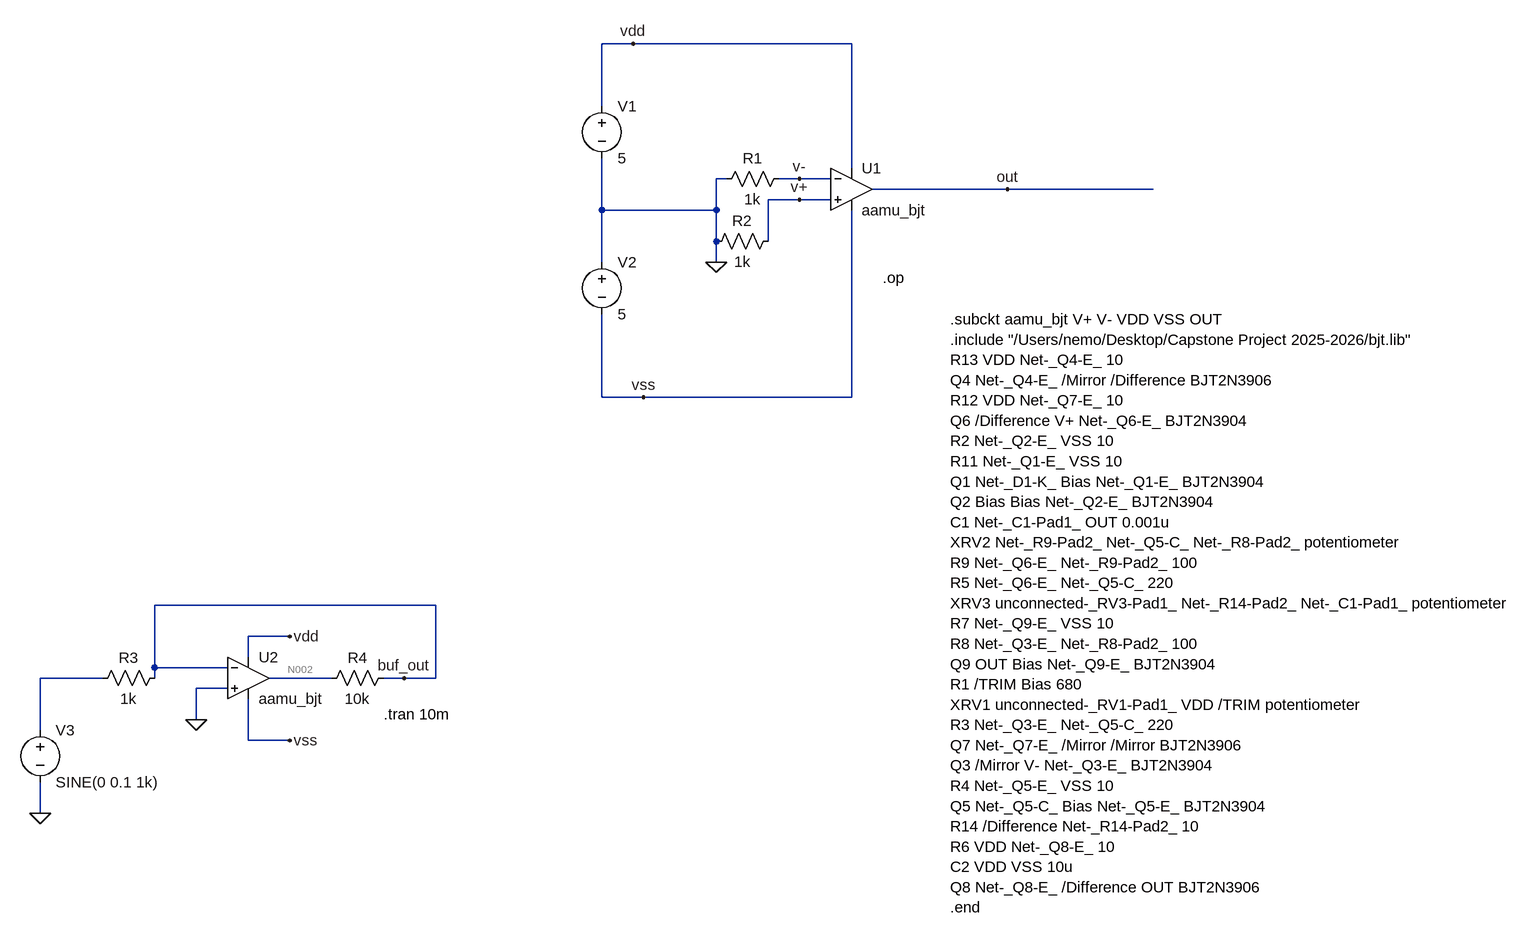
[diagram p0: schematic BJT_Op-Amp_Test.asc]
BJT_Op-Amp_Test.asc, the LTspice schematic file:
Version 4
SHEET 1 1656 1208
WIRE 176 0 128 0
WIRE 512 0 176 0
WIRE 128 96 128 0
WIRE 512 192 512 0
WIRE 320 208 304 208
WIRE 432 208 400 208
WIRE 480 208 432 208
WIRE 752 224 544 224
WIRE 976 224 752 224
WIRE 432 240 384 240
WIRE 480 240 432 240
WIRE 128 256 128 176
WIRE 304 256 304 208
WIRE 304 256 128 256
WIRE 304 304 304 256
WIRE 384 304 384 240
WIRE 128 336 128 256
WIRE 304 336 304 304
WIRE 128 544 128 416
WIRE 192 544 128 544
WIRE 512 544 512 256
WIRE 512 544 192 544
WIRE -128 864 -560 864
WIRE -352 912 -416 912
WIRE -416 944 -416 912
WIRE -560 960 -560 864
WIRE -448 960 -560 960
WIRE -640 976 -736 976
WIRE -560 976 -560 960
WIRE -288 976 -384 976
WIRE -176 976 -208 976
WIRE -128 976 -128 864
WIRE -128 976 -176 976
WIRE -448 992 -496 992
WIRE -496 1040 -496 992
WIRE -736 1056 -736 976
WIRE -416 1072 -416 1008
WIRE -352 1072 -416 1072
WIRE -736 1184 -736 1136
FLAG 304 336 0
FLAG 752 224 out
FLAG 176 0 vdd
FLAG 192 544 vss
FLAG 432 208 v-
FLAG 432 240 v+
FLAG -736 1184 0
FLAG -496 1040 0
FLAG -352 912 vdd
FLAG -352 1072 vss
FLAG -176 976 buf_out
DATAFLAG 896 224 "$"
DATAFLAG 384 0 "$"
DATAFLAG 432 544 "$"
SYMBOL OpAmps/opamp2 512 160 R0
SYMATTR InstName U1
SYMATTR Value aamu_bjt
SYMBOL voltage 128 80 R0
SYMATTR InstName V1
SYMATTR Value 5
SYMBOL voltage 128 320 R0
SYMATTR InstName V2
SYMATTR Value 5
SYMBOL res 416 192 R90
WINDOW 0 0 56 VBottom 2
WINDOW 3 32 56 VTop 2
SYMATTR InstName R1
SYMATTR Value 1k
SYMBOL res 400 288 R90
WINDOW 0 0 56 VBottom 2
WINDOW 3 32 56 VTop 2
SYMATTR InstName R2
SYMATTR Value 1k
SYMBOL OpAmps/opamp2 -416 912 R0
SYMATTR InstName U2
SYMATTR Value aamu_bjt
SYMBOL res -544 960 R90
WINDOW 0 0 56 VBottom 2
WINDOW 3 32 56 VTop 2
SYMATTR InstName R3
SYMATTR Value 1k
SYMBOL res -192 960 R90
WINDOW 0 0 56 VBottom 2
WINDOW 3 32 56 VTop 2
SYMATTR InstName R4
SYMATTR Value 10k
SYMBOL voltage -736 1040 R0
SYMATTR InstName V3
SYMATTR Value SINE(0 0.1 1k)
TEXT 560 360 Left 2 !.op
TEXT 664 424 Left 2 !.subckt aamu_bjt V+ V- VDD VSS OUT\n.include "/Users/nemo/Desktop/Capstone Project 2025-2026/bjt.lib"\nR13 VDD Net-_Q4-E_ 10\nQ4 Net-_Q4-E_ /Mirror /Difference BJT2N3906\nR12 VDD Net-_Q7-E_ 10\nQ6 /Difference V+ Net-_Q6-E_ BJT2N3904\nR2 Net-_Q2-E_ VSS 10\nR11 Net-_Q1-E_ VSS 10\nQ1 Net-_D1-K_ Bias Net-_Q1-E_ BJT2N3904\nQ2 Bias Bias Net-_Q2-E_ BJT2N3904\nC1 Net-_C1-Pad1_ OUT 0.001u\nXRV2 Net-_R9-Pad2_ Net-_Q5-C_ Net-_R8-Pad2_ potentiometer\nR9 Net-_Q6-E_ Net-_R9-Pad2_ 100\nR5 Net-_Q6-E_ Net-_Q5-C_ 220\nXRV3 unconnected-_RV3-Pad1_ Net-_R14-Pad2_ Net-_C1-Pad1_ potentiometer\nR7 Net-_Q9-E_ VSS 10\nR8 Net-_Q3-E_ Net-_R8-Pad2_ 100\nQ9 OUT Bias Net-_Q9-E_ BJT2N3904\nR1 /TRIM Bias 680\nXRV1 unconnected-_RV1-Pad1_ VDD /TRIM potentiometer\nR3 Net-_Q3-E_ Net-_Q5-C_ 220\nQ7 Net-_Q7-E_ /Mirror /Mirror BJT2N3906\nQ3 /Mirror V- Net-_Q3-E_ BJT2N3904\nR4 Net-_Q5-E_ VSS 10\nQ5 Net-_Q5-C_ Bias Net-_Q5-E_ BJT2N3904\nR14 /Difference Net-_R14-Pad2_ 10\nR6 VDD Net-_Q8-E_ 10\nC2 VDD VSS 10u\nQ8 Net-_Q8-E_ /Difference OUT BJT2N3906\n.end
TEXT -208 1032 Left 2 !.tran 10m

The netlist it stands for:
* BJT_Op-Amp_Test.asc
XU1 v+ v- vdd vss out aamu_bjt  ; pins In+ In- V+ V- OUT
V1 vdd 0 5
V2 0 vss 5
R1 v- 0 1k
R2 v+ 0 1k
XU2 0 buf_out vdd vss N002 aamu_bjt  ; pins In+ In- V+ V- OUT
R3 buf_out N001 1k
R4 buf_out N002 10k
V3 N001 0 SINE(0 0.1 1k)
.op
.subckt aamu_bjt V+ V- VDD VSS OUT
.include "/Users/nemo/Desktop/Capstone Project 2025-2026/bjt.lib"
R13 VDD Net-_Q4-E_ 10
Q4 Net-_Q4-E_ /Mirror /Difference BJT2N3906
R12 VDD Net-_Q7-E_ 10
Q6 /Difference V+ Net-_Q6-E_ BJT2N3904
R2 Net-_Q2-E_ VSS 10
R11 Net-_Q1-E_ VSS 10
Q1 Net-_D1-K_ Bias Net-_Q1-E_ BJT2N3904
Q2 Bias Bias Net-_Q2-E_ BJT2N3904
C1 Net-_C1-Pad1_ OUT 0.001u
XRV2 Net-_R9-Pad2_ Net-_Q5-C_ Net-_R8-Pad2_ potentiometer
R9 Net-_Q6-E_ Net-_R9-Pad2_ 100
R5 Net-_Q6-E_ Net-_Q5-C_ 220
XRV3 unconnected-_RV3-Pad1_ Net-_R14-Pad2_ Net-_C1-Pad1_ potentiometer
R7 Net-_Q9-E_ VSS 10
R8 Net-_Q3-E_ Net-_R8-Pad2_ 100
Q9 OUT Bias Net-_Q9-E_ BJT2N3904
R1 /TRIM Bias 680
XRV1 unconnected-_RV1-Pad1_ VDD /TRIM potentiometer
R3 Net-_Q3-E_ Net-_Q5-C_ 220
Q7 Net-_Q7-E_ /Mirror /Mirror BJT2N3906
Q3 /Mirror V- Net-_Q3-E_ BJT2N3904
R4 Net-_Q5-E_ VSS 10
Q5 Net-_Q5-C_ Bias Net-_Q5-E_ BJT2N3904
R14 /Difference Net-_R14-Pad2_ 10
R6 VDD Net-_Q8-E_ 10
C2 VDD VSS 10u
Q8 Net-_Q8-E_ /Difference OUT BJT2N3906
.end
.tran 10m
.backanno
.end

* Results of the author's LTspice run, read from the files saved beside the schematic
* Operating Point, zero values left out:
*   V(vdd) = 5 V
*   V(v+) = -17.09 mV
*   V(vss) = -5 V
*   V(out) = -4.923 V
*   V(v-) = -17.08 mV
*   V(n002) = -4.915 V
*   V(buf_out) = -453.5 mV
*   I(R1) = -17.08 µA
*   I(R2) = -17.09 µA
*   I(R3) = -453.5 µA
*   I(R4) = 446.1 µA
*   I(V1) = -36.45 mA
*   I(V2) = -36.97 mA
*   I(V3) = -453.5 µA
*   Ix(u1:V+) = 17.09 µA
*   Ix(u1:V-) = 17.08 µA
*   Ix(u1:VDD) = 8.212 mA
*   Ix(u1:VSS) = -18.17 mA
*   Ix(u2:V+) = 27.78 µA
*   Ix(u2:V-) = 7.409 µA
*   Ix(u2:VDD) = 8.401 mA
*   Ix(u2:VSS) = -18.8 mA
*   Ix(u2:OUT) = 446.1 µA
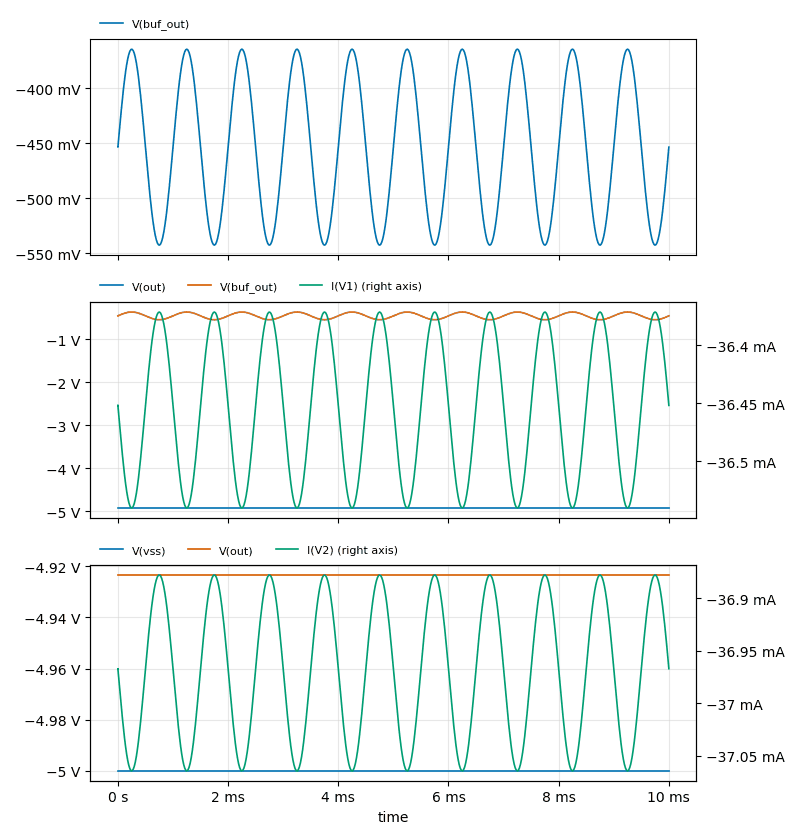
[diagram p1: Transient Analysis of BJT_Op-Amp_Test.asc, plotted from the saved traces]
* Transient Analysis, 1 run:
*   V(buf_out): min -542.7 mV, max -364.4 mV, average -453.5 mV, rms 457.9 mV, last -453.5 mV
*   V(out): min -4.923 V, max -4.923 V, average -4.923 V, rms 4.923 V, last -4.923 V
*   V(buf_out): min -542.7 mV, max -364.4 mV, average -453.5 mV, rms 457.9 mV, last -453.5 mV
*   I(V1): min -36.54 mA, max -36.37 mA, average -36.45 mA, rms 36.45 mA, last -36.45 mA
*   V(vss): min -5 V, max -5 V, average -5 V, rms 5 V, last -5 V
*   V(out): min -4.923 V, max -4.923 V, average -4.923 V, rms 4.923 V, last -4.923 V
*   I(V2): min -37.06 mA, max -36.88 mA, average -36.97 mA, rms 36.97 mA, last -36.97 mA